# EAGLE schematic conduct-555-2 (EAGLE 6.5.0)
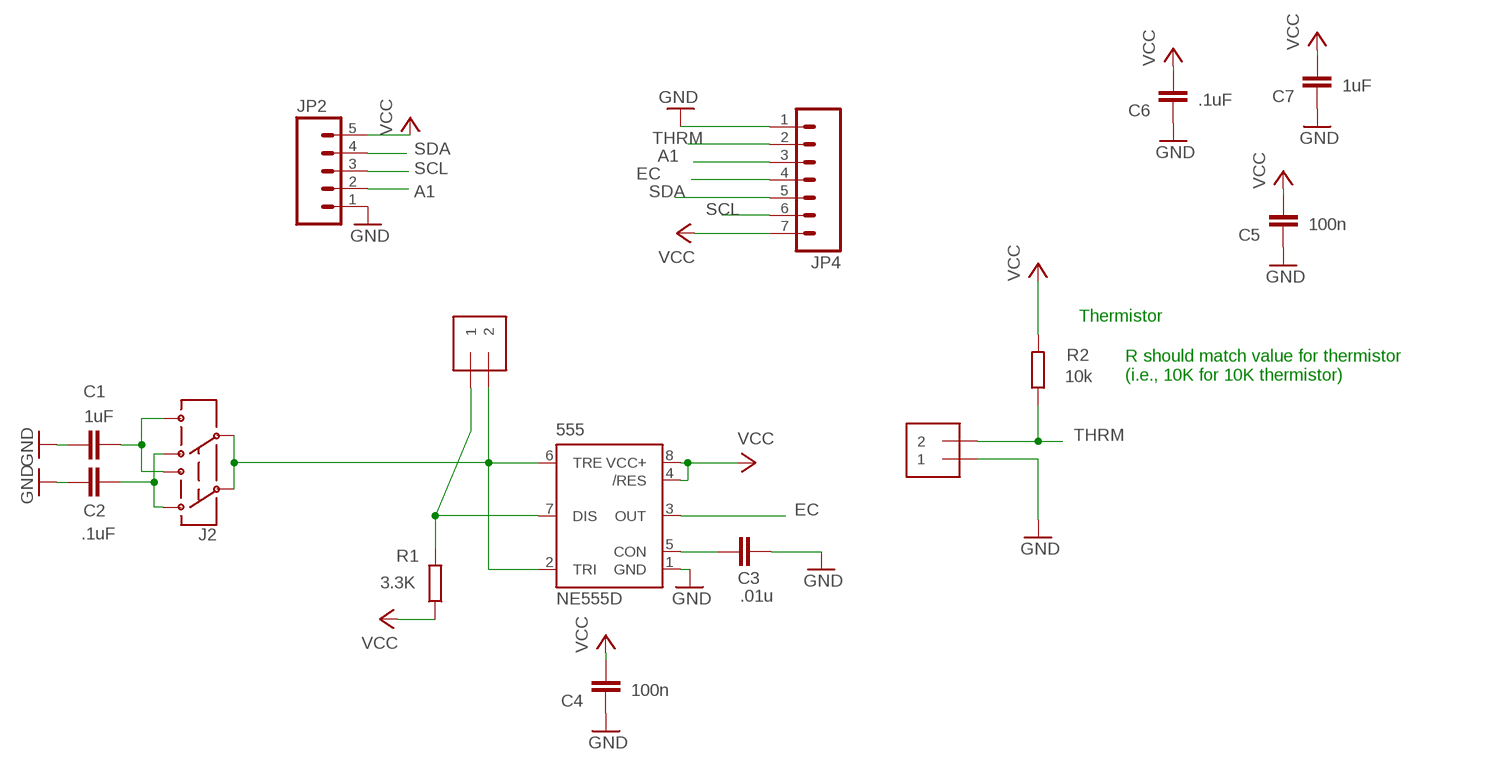
[diagram p0: schematic, sheet 1]

## Parts
555  NE555D  [SO08@1]
C1  1uF  C-EUC0805  [C0805]
C2  .1uF  C-EUC0805  [C0805]
C3  .01u  C-EUC0805  [C0805]
C4  100n  C-EUC0805  [C0805]
C5  100n  C-EUC0805  [C0805]
C6  .1uF  C-EUC0805  [C0805]
C7  1uF  C-EUC0805  [C0805]
EC  1X2-3.5MM  [1X2-3.5MM]
J2  AYZ0202  [AYZ0202]
JP2  M05PTH  [1X05]
JP4  M07  [1X07]
R1  3.3K  R-EU_R0805  [R0805]
R2  10k  R-EU_R0805  [R0805]
THRM  1X2-3.5MM  [1X2-3.5MM]

## Nets
A1: JP2.2 JP4.3
EC: 555.3(OUT) JP4.4
GND: 555.1(GND) C1.2 C2.2 C3.1 C4.1 C5.1 C6.1 C7.1 JP2.1 JP4.1 THRM.1
N1: 555.2(TRI) 555.6(TRE) EC.2 J2.2 J2.5
N$2: 555.5(CON) C3.2
N$3: 555.7(DIS) EC.1 R1.2
N$6: C2.1 J2.3 J2.6
SCL: JP2.3 JP4.6
SDA: JP2.4 JP4.5
THRM: JP4.2 R2.1 THRM.2
VCC: 555.4(/RES) 555.8(VCC+) C4.2 C5.2 C6.2 C7.2 JP2.5 JP4.7 R1.1 R2.2
VDD2: C1.1 J2.1 J2.4

## Notes on the sheet
- Thermistor
- R should match value for thermistor
  (i.e., 10K for 10K thermistor)

## Library data of the parts
555 = SparkFun-AnalogIC:NE555: General purpose bipolar Timer
C1-C7 = resistor:C-EU: CAPACITOR, European symbol
EC THRM = adafruit:1X2: 3.5mm Terminal block http://www.ladyada.net/library/pcb/eaglelibrary.html
J2 = SparkFunNew:AYZ0202: SPDT Slide Switch Simple SMD single-pull double-throw slide switch. Good for less than 350mA power switch, switching UARTs between devices, etc. Spark Fun Electronics SKU : COM-00597
JP2 = SparkFun-Connectors:M05: Header 5 Standard 5-pin 0.1" header. Use with straight break away headers (SKU : PRT-00116), right angle break away headers (PRT-00553), swiss pins (PRT-00743), machine pins (PRT-00117), and female headers (PRT-00115). Molex polarized connector foot print use with SKU : PRT-08230 with associated crimp pins and housings.
JP4 = SparkFun-Connectors:M07: Header 7 Standard 7-pin 0.1" header. Use with straight break away headers (SKU : PRT-00116), right angle break away headers (PRT-00553), swiss pins (PRT-00743), machine pins (PRT-00117), and female headers (PRT-00115). NOTES ON THE VARIANTS LOCK and LOCK_LONGPADS... This footprint was designed to help hold the alignment of a through-hole component (i.e. 7-pin header) while soldering it into place. You may notice that each hole has been shifted either up or down by 0.005 of an inch from it's more standard position (which is usually a perfectly straight line). This slight alteration caused the pins (the squares in the middle) to touch the edges of the holes. Because they are alternating, it causes a "brace" to hold the header in place. 0.005 has proven to be the perfect amount of "off-center" position when using our standard breakaway headers. Although looks a little odd when you look at the bare footprint, once you have a header in there, the alteration is very hard to notice. Also, if you push a header all the way into place, it is covered up entirely on the bottom side. This idea of altering the position of holes to aid alignment will be further integrated into the Sparkfun Library for other footprints. It can help hold any component with 3 or more connection pins.
R1 R2 = rcl:R-EU_: RESISTOR, European symbol

## Net classes
0 default: width 0.203 mm, drill 0.33 mm, clearance 0.203 mm